# Altium schematic sheet Display.SchDoc: Display Soldeerbout
size A4; DrawnBy: Robbe Th.; Revision: 1; SheetNumber: 5; SheetTotal: 5; Number: PXL_SEM2_SB05R1
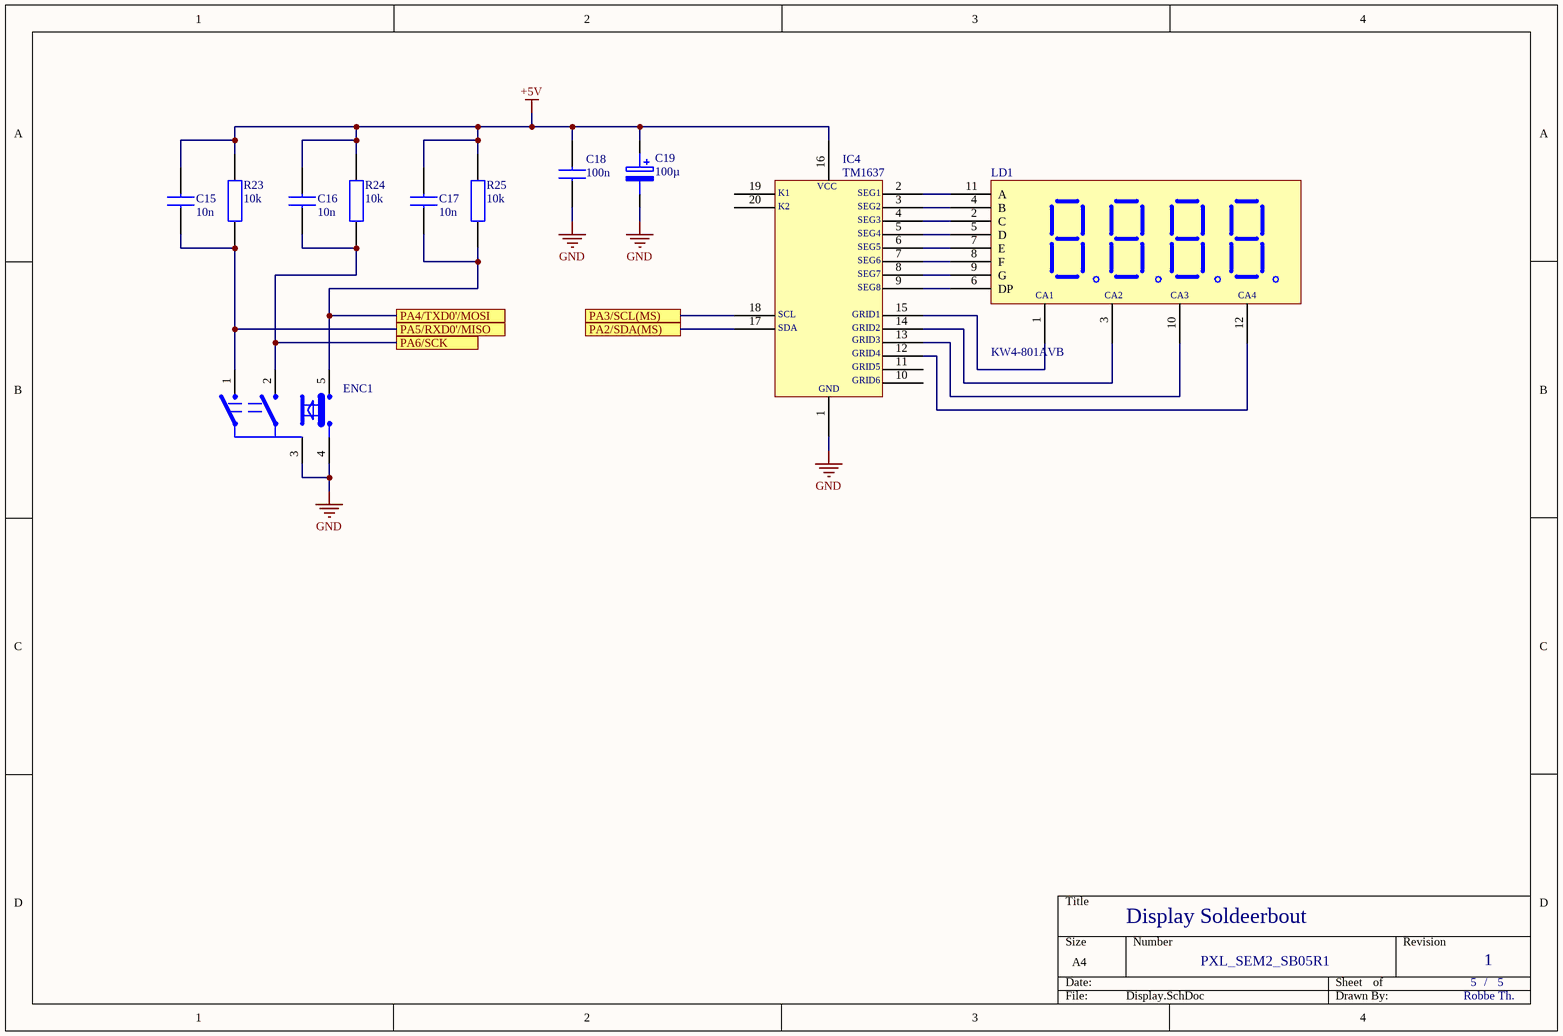
[diagram p0: Display.SchDoc]

## Parts
C15  10n  [CAPC1005X56N]
C16  10n  [CAPC1005X56N]
C17  10n  [CAPC1005X56N]
C18  100n  [CAPC1005X56N]
C19  100µ  [CAPPRD350W60D825H1300]
ENC1  PEC11R-4225F-S0024  [PEC12R-4XXXF-SXXXX_1]  (value not drawn)
IC4  TM1637  [SOIC127P1045X280-20N]
LD1  KW4-801AVB  [KW4-801AVB-FP]
R23  10k  [RESC2012X65N]
R24  10k  [RESC2012X65N]
R25  10k  [RESC2012X65N]

## Ports
PA2/SDA(MS), PA3/SCL(MS), PA4/TXD0'/MOSI, PA5/RXD0'/MISO, PA6/SCK

## Nets
+5V: C15.2 C16.2 C17.2 C18.2 C19.1(+) IC4.16 R23.2 R24.2 R25.2
GND: C18.1 C19.2(-) ENC1.3 ENC1.4 IC4.1
PA2/SDA(MS): IC4.17 ; port PA2/SDA(MS)
PA3/SCL(MS): IC4.18 ; port PA3/SCL(MS)
PA4/TXD0'/MOSI: C17.1 ENC1.5 R25.1 ; port PA4/TXD0'/MOSI
PA5/RXD0'/MISO: C15.1 ENC1.1 R23.1 ; port PA5/RXD0'/MISO
PA6/SCK: C16.1 ENC1.2 R24.1 ; port PA6/SCK
NetIC4_2: IC4.2 LD1.11(A)
NetIC4_3: IC4.3 LD1.4(B)
NetIC4_4: IC4.4 LD1.2(C)
NetIC4_5: IC4.5 LD1.5(D)
NetIC4_6: IC4.6 LD1.7(E)
NetIC4_7: IC4.7 LD1.8(F)
NetIC4_8: IC4.8 LD1.9(G)
NetIC4_9: IC4.9 LD1.6(DP)
NetIC4_12: IC4.12 LD1.12
NetIC4_13: IC4.13 LD1.10
NetIC4_14: IC4.14 LD1.3
NetIC4_15: IC4.15 LD1.1(CA1)

Not connected (* = marked no-connect by the designer): IC4 10 11 19 20

## Notes on the sheet
- /
- (in symbol KW4-801AVB) CA2; CA3; CA4
- (in symbol TM1637) VCC; K1; SEG1; K2; SEG2; SEG3; SEG4; SEG5; SEG6; SEG7; SEG8; SCL; GRID1; SDA; GRID2; GRID3; GRID4; GRID5; GRID6; GND

## Library data of the parts
C15-C18 = 0402YC104MAT2A: Capacitor SMD 0805; Manufacturer_Name: AVX; Datasheet Link: http://www.mouser.com/catalog/supplier/library/pdf/AVXSurfaceMountCeramic.pdf; Height: 0.56mm; Manufacturer_Part_Number: 0402YC104MAT2A; Mouser Part Number: 581-0402YC104MAT2A; Mouser Price/Stock: https://www.mouser.co.uk/ProductDetail/AVX/0402YC104MAT2A?qs=O2%2FeDh0sX9yiCaLwpXy1bw%3D%3D
C19 = RGA101M1HBK-0811G: ELCO 100 uF; Manufacturer_Name: Lelon; Datasheet Link: https://www.arrow.com/en/products/rga101m1hbk-0811g/lelon-electronics; Height: 13mm; Manufacturer_Part_Number: RGA101M1HBK-0811G; Mouser Part Number: 140-RGA101M1HBK0811G; Mouser Price/Stock: https://www.mouser.co.uk/ProductDetail/Lelon/RGA101M1HBK-0811G?qs=pNDdEcSXiOBNivHdElCSJA%3D%3D; Arrow Part Number: RGA101M1HBK-0811G; Arrow Price/Stock: https://www.arrow.com/en/products/rga101m1hbk-0811g/lelon-electronics
ENC1 = PEC11R-4225F-S0024: Rotary Button; Manufacturer_Name: Bourns; Datasheet Link: https://componentsearchengine.com/Datasheets/1/PEC11R-4225F-S0024.pdf; Manufacturer_Part_Number: PEC11R-4225F-S0024; Mouser Part Number: 652-PEC11R-4225F-S24; Mouser Price/Stock: https://www.mouser.co.uk/ProductDetail/Bourns/PEC11R-4225F-S0024?qs=Zq5ylnUbLm4N6UNkPX3pkQ%3D%3D; Arrow Part Number: PEC11R-4225F-S0024; Arrow Price/Stock: https://www.arrow.com/en/products/pec11r-4225f-s0024/bourns?region=nac
IC4 = TM1637: Driver LED Display; Manufacturer_Name: TITAN MICRO ELECTRONICS; Manufacturer_Part_Number: TM1637 (SOP); Datasheet Link: https://www.mcielectronics.cl/website_MCI/static/documents/Datasheet_TM1637.pdf; Height: 2.8mm
LD1 = KW4-801AVB: 4-Digit LED Display
R23-R25 = CPF0805B100RE1: Resistor SMD 0805; Manufacturer_Name: TE Connectivity; Datasheet Link: https://datasheet.datasheetarchive.com/originals/distributors/DKDS-21/401696.pdf; Height: 0.65mm; Manufacturer_Part_Number: CPF0805B100RE1; Mouser Part Number: 279-CPF0805B100RE1; Mouser Price/Stock: https://www.mouser.co.uk/ProductDetail/TE-Connectivity-Holsworthy/CPF0805B100RE1?qs=9ylKvqdyudkCWLPT1QvLZQ%3D%3D; Arrow Part Number: CPF0805B100RE1; Arrow Price/Stock: https://www.arrow.com/en/products/cpf0805b100re1/te-connectivity?region=nac